# Altium schematic sheet LM331+MCU.SchDoc
size A4
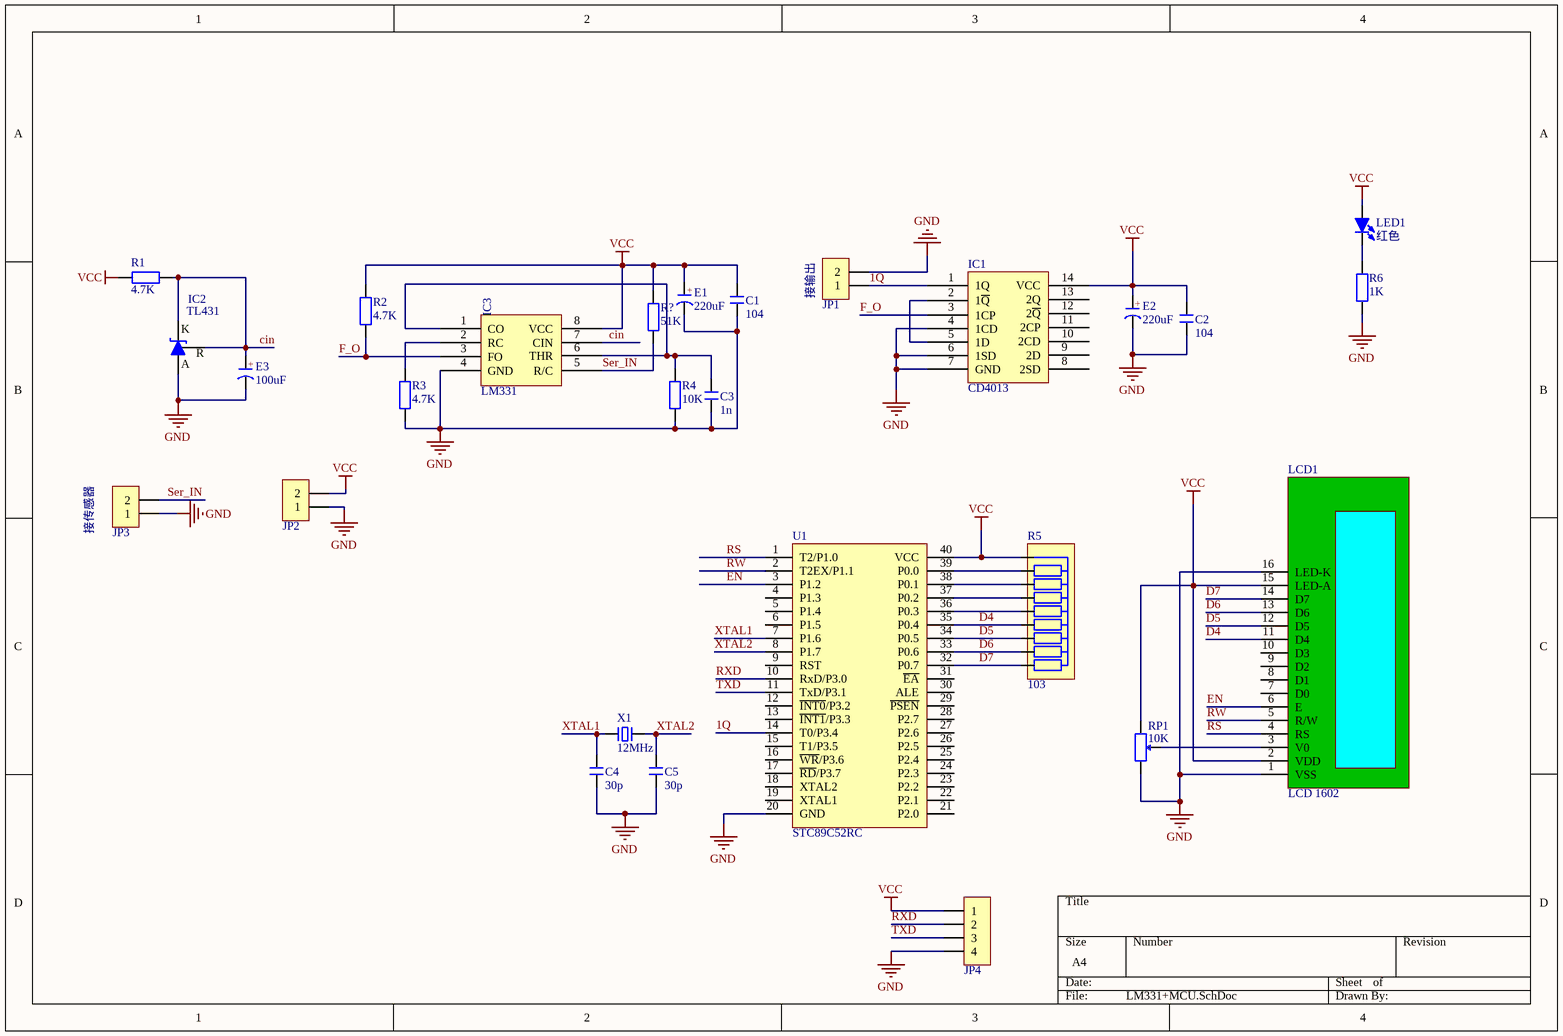
[diagram p0: LM331+MCU.SchDoc]

## Parts
C1  104  [C 0805_M]
C2  104  [C 0805_M]
C3  1n  [C 0805_M]
C4  30p  [C 0805_M]
C5  30p  [C 0805_M]
E1  220uF  [CAP 3.5*8*11.5]
E2  220uF  [CAP 3.5*8*11.5]
E3  100uF  [CAP 3.5*8*11.5]
IC1  CD4013  [SOP14_M]
IC2  TL431  [TO92A]
IC3  LM331  [SOP8_M]
JP1  HDR-1X2  [XH2.54-LI-2P]  (value not drawn)
JP2  HDR-1X2  [XH2.54-LI-2P]  (value not drawn)
JP3  HDR-1X2  [KF2EDGK5.0-LI-2P]  (value not drawn)
JP4  HDR-1X4  [HDR2.54-LI-4P]  (value not drawn)
LCD1  LCD 1602  [LCD-1602]
LED1  红色  [LED 5MM-B]
R1  4.7K  [R 0805_M]
R2  4.7K  [R 0805_M]
R3  4.7K  [R 0805_M]
R4  10K  [R 0805_M]
R5  103  [R SIP9-2.54]
R6  1K  [RS 1/4W]
R?  51K  [R 0805_M]
RP1  10K  [RM065]
U1  STC89C52RC  [DIP40-600]
X1  12MHz  [OSC HC-49S]

## Nets
GND: C1.1 C2.1 C3.1 C4.1 C5.1 E1.2(K) E2.2(K) E3.2(K) IC1.4(1CD) IC1.6(1SD) IC1.7(GND) IC2.2(A) IC3.4(GND) JP1.2 JP2.1 JP3.1 JP4.4 LCD1.1(VSS) LCD1.16(LED-K) R3.1 R4.1 R6.1 RP1.3 U1.20(GND)
VCC: C1.2 C2.2 E1.1(A) E2.1(A) IC1.14(VCC) IC3.8(VCC) JP2.2 JP4.1 LCD1.2(VDD) LCD1.15(LED-A) LED1.1(A) R1.2 R2.2 R5.1 R?.2 RP1.1 U1.40(VCC)
1Q: IC1.1(1Q) JP1.1 U1.14(T0/P3.4)
cin: E3.1(A) IC2.1(R) IC2.3(K) IC3.7(CIN) R1.1
D4: LCD1.11(D4) R5.6 U1.35(P0.4)
D5: LCD1.12(D5) R5.7 U1.34(P0.5)
D6: LCD1.13(D6) R5.8 U1.33(P0.6)
D7: LCD1.14(D7) R5.9 U1.32(P0.7)
EN: LCD1.6(E) U1.3(P1.2)
F_O: IC1.3(1CP) IC3.3(FO) R2.1
RS: LCD1.4(RS) U1.1(T2/P1.0)
RW: LCD1.5(R/W) U1.2(T2EX/P1.1)
RXD: JP4.2 U1.10(RxD/P3.0)
Ser_IN: IC3.5(R/C) JP3.2 R?.1
TXD: JP4.3 U1.11(TxD/P3.1)
XTAL1: C4.2 U1.7(P1.6) X1.1
XTAL2: C5.2 U1.8(P1.7) X1.2
NetC3_2: C3.2 IC3.1(CO) IC3.6(THR) R4.2
NetIC1_2: IC1.2(1~{Q}) IC1.5(1D)
NetIC3_2: IC3.2(RC) R3.2
NetLCD1_3: LCD1.3(V0) RP1.2
NetLED1_2: LED1.2(K) R6.2
NetR5_2: R5.2 U1.39(P0.0)
NetR5_3: R5.3 U1.38(P0.1)
NetR5_4: R5.4 U1.37(P0.2)
NetR5_5: R5.5 U1.36(P0.3)

Not connected (* = marked no-connect by the designer): IC1 8(2SD) 9(2D) 10(2CD) 11(2CP) 12(2~{Q}) 13(2Q); LCD1 7(D0) 8(D1) 9(D2) 10(D3); U1 4(P1.3) 5(P1.4) 6(P1.5) 9(RST) 12(~{INT0}/P3.2) 13(~{INT1}/P3.3) 15(T1/P3.5) 16(~{WR}/P3.6) 17(~{RD}/P3.7) 18(XTAL2) 19(XTAL1) 21(P2.0) 22(P2.1) 23(P2.2) 24(P2.3) 25(P2.4) 26(P2.5) 27(P2.6) 28(P2.7) 29(~{PSEN}) 30(ALE) 31(~{EA})

## Notes on the sheet
- (near JP1) 接输出
- (near JP3) 接传感器
- (in symbol C-CAP) +

## Library data of the parts
C1-C5 = C: 无极性贴片电容; 版权归属: 源创客; BOM名称: 无极性贴片电容; 学习资源: www.ooocke.com
E1-E3 = C-CAP: 直插电解电容; 版权归属: 源创客; BOM名称: 直插电解电容; 学习资源: www.ooocke.com
IC2 = TL431-ID: 可调基准稳压芯片; 版权归属: 源创客; BOM名称: 可调基准稳压芯片; 学习资源: www.ooocke.com
IC3 = LM331: 频率电压转换器
JP1-JP3 = Header 2: 2P接插件; 版权归属: 源创客; BOM名称: 2P接插件; 学习资源: www.ooocke.com
JP4 = Header 4: 4P接插件; 版权归属: 源创客; BOM名称: 4P接插件; 学习资源: www.ooocke.com
LCD1 = LCD 1602: 版权归属: 源创客; BOM名称: LCD 1602; 学习资源: www.ooocke.com
LED1 = LED-5MM: 5mm插件LED; 版权归属: 源创客; BOM名称: 5mm插件LED; 学习资源: www.ooocke.com
R1-R4 R? = R: 贴片电阻; 版权归属: 源创客; BOM名称: 贴片电阻; 学习资源: www.ooocke.com
R5 = R SIP9: 单列直插排阻; 版权归属: 源创客; BOM名称: 单列直插排阻; 学习资源: www.ooocke.com
R6 = R-CRR: 直插色环电阻; BOM名称: 色环电阻; 版权归属: 源创客; 学习资源: www.ooocke.com
RP1 = RP-ID: 插件单联电位器; BOM名称: 插件电位器; 版权归属: 源创客; 学习资源: www.ooocke.com
U1 = STC89C52RC: STC单片机; 版权归属: 源创客; BOM名称: STC单片机; 学习资源: www.ooocke.com
X1 = XTAL-2P: 2脚无源脚晶振; 版权归属: 源创客; BOM名称: 2脚无源脚晶振; 学习资源: www.ooocke.com